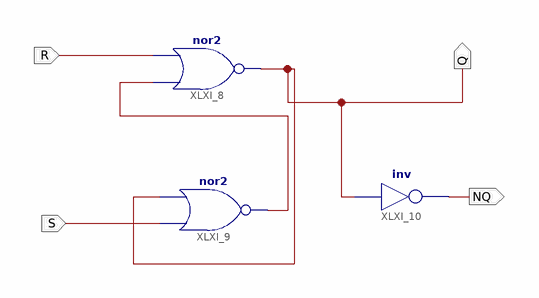
[diagram p0: schematic sheet 1]
// Xilinx ISE schematic Latch_RS.sch (spartan3e) as structural Verilog: 3 symbols, 4 ports
module Latch_RS (
  input  S,
  input  R,
  output Q,
  output NQ
);

  wire XLXN_2;

  nor XLXI_8 (Q, XLXN_2, R);
  nor XLXI_9 (XLXN_2, S, Q);
  not XLXI_10 (NQ, Q);
endmodule
